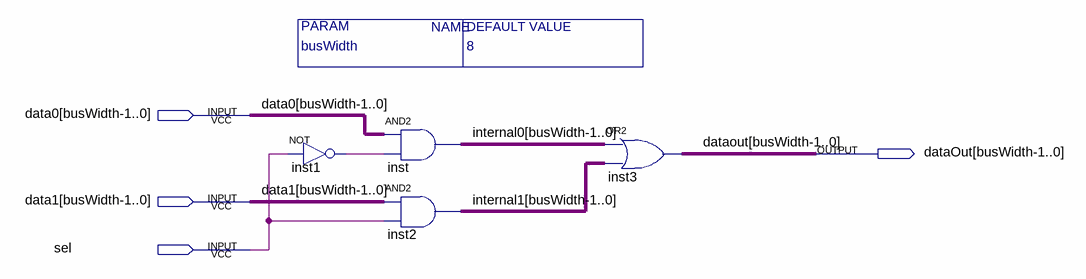
[diagram p0: schematic sheet]
// Quartus schematic multiplekser.bdf as structural Verilog: 4 symbols, 4 pins
module multiplekser #(parameter busWidth = 8) (
  input  [7:0] data0,
  input  [7:0] data1,
  input  sel,
  output [7:0] dataOut
);

  wire inst1_out;
  wire [7:0] internal0, internal1;

  not inst1 (inst1_out, sel);
  assign internal0 = data0 & {8{inst1_out}};  // AND2 inst, 8 bits wide
  assign internal1 = data1 & {8{sel}};  // AND2 inst2, 8 bits wide
  assign dataOut = internal0 | internal1;  // OR2 inst3, 8 bits wide
endmodule
